# EAGLE board EEZ Arduino shield+BP r2B6b (EAGLE 6.1), part 1 of 2
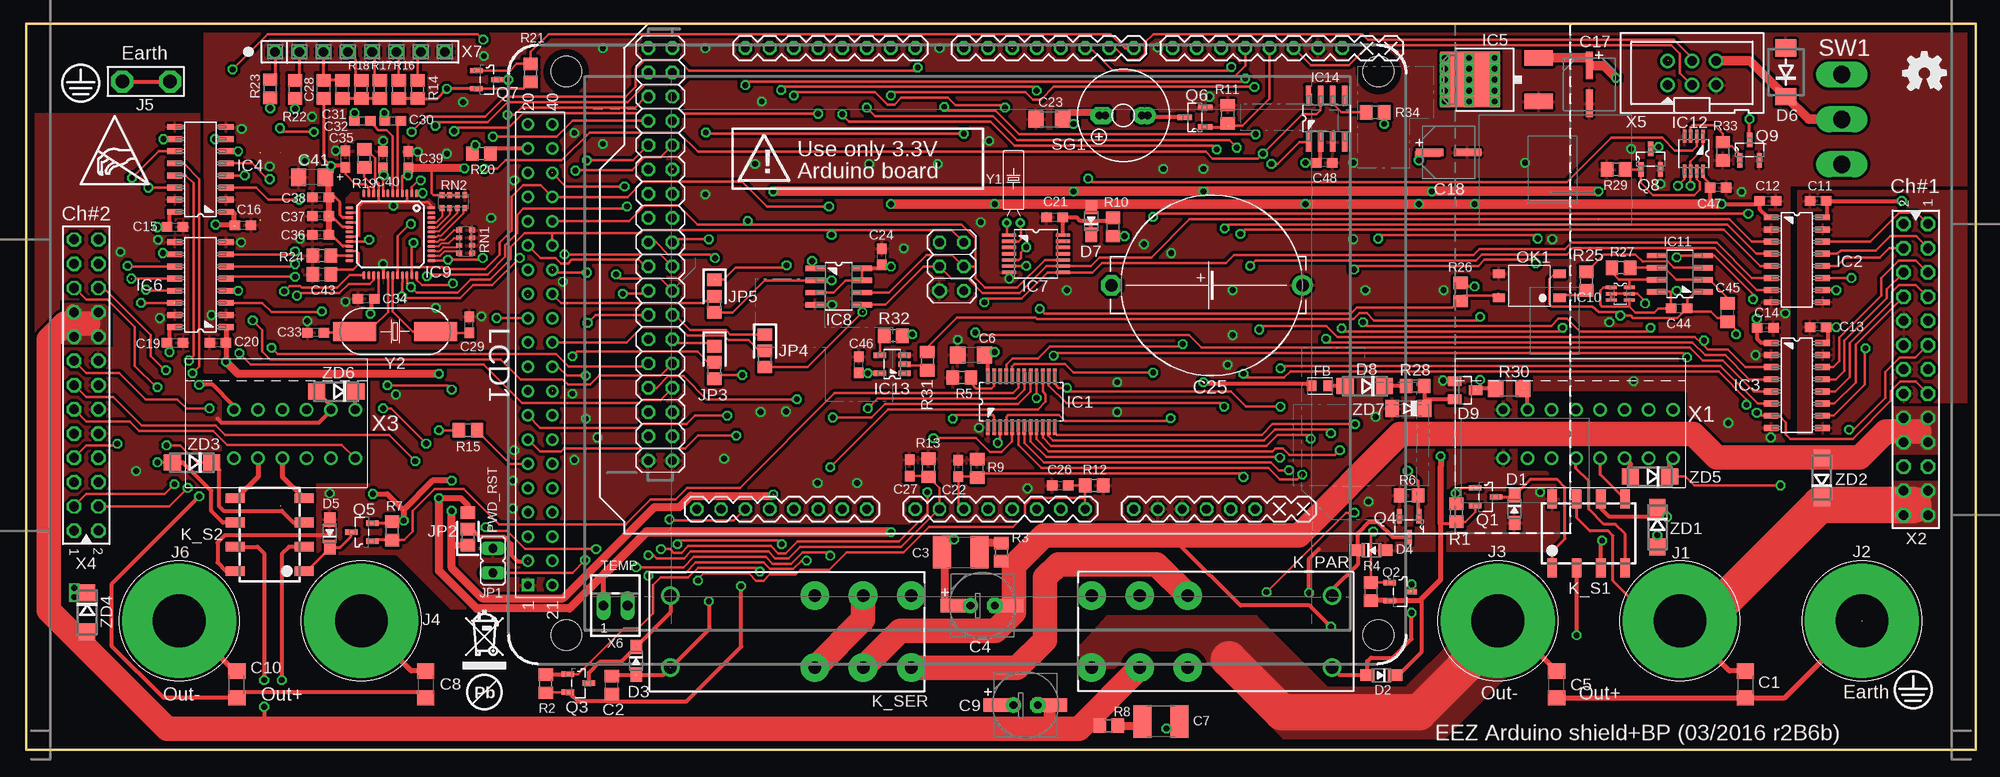
[diagram p4: board, top side]
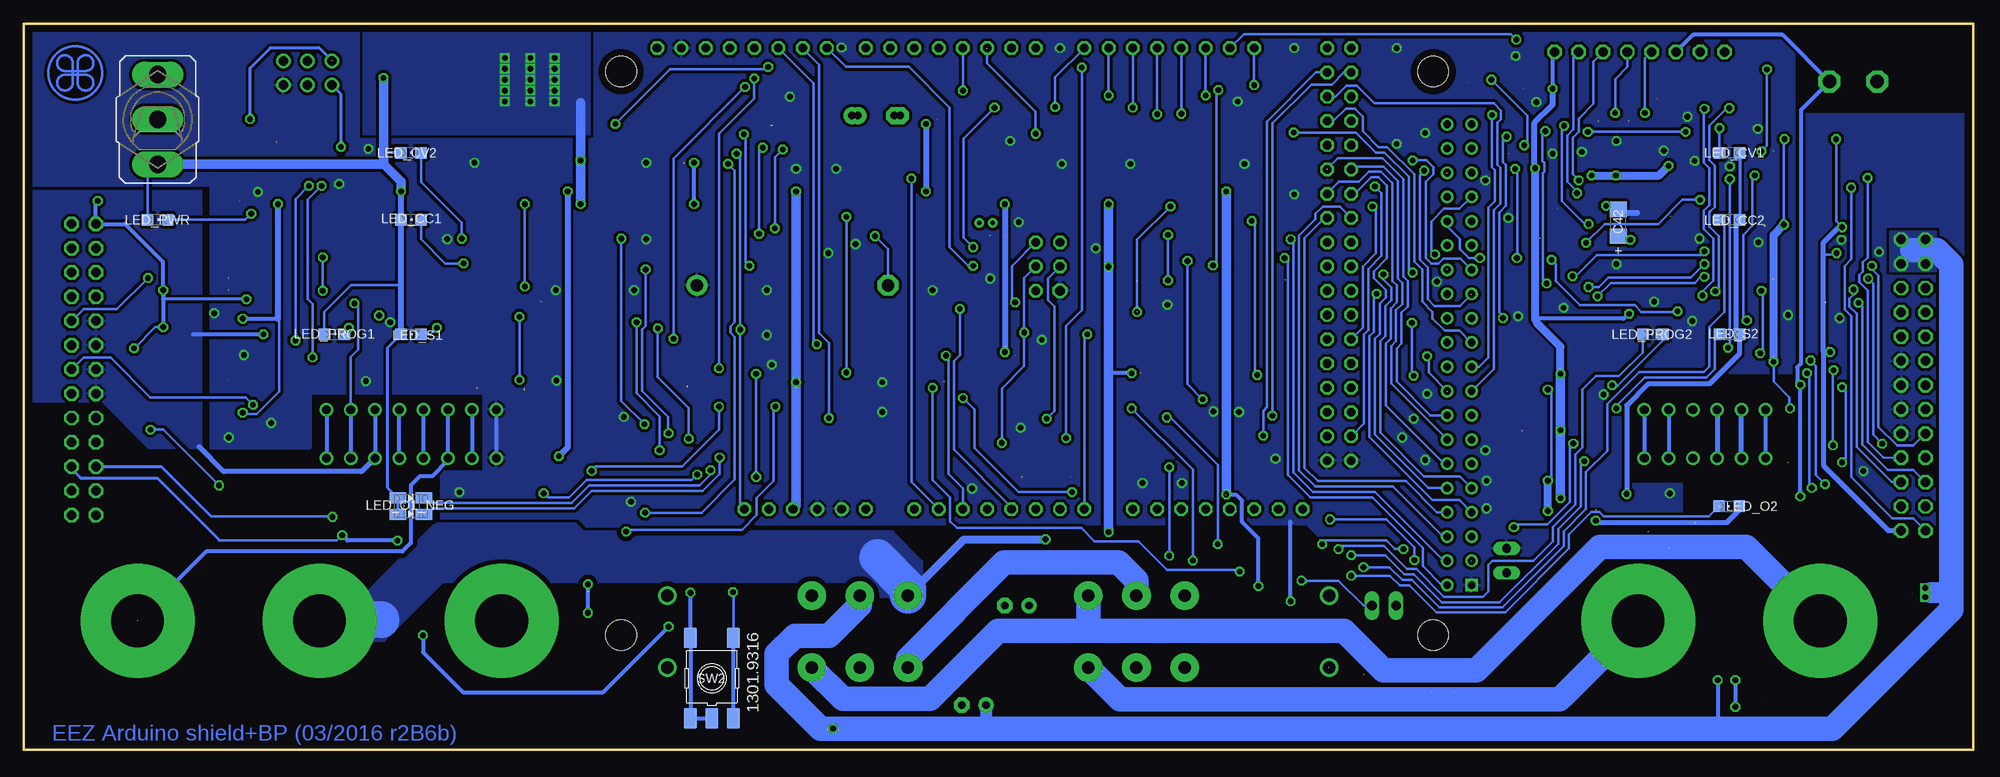
[diagram p5: board, bottom side, seen from below]

Size 204 x 76 mm. Coordinates in mm from the lower left corner, seen from the top.
Outline: 0,0 0,76 204,76 204,0 0,0
Copper layers (1+5*16): Top 0.035mm / dielectric 0.75mm / Route5 0.035mm / dielectric 0.75mm / Bottom 0.035mm
Design rules: minimum track width 10mil, minimum drill 0.5mm, track to track 8mil, track to pad 8mil, pad to pad 8mil, via to via 8mil, smd to smd 8mil, copper to edge 30mil, drill to drill 8mil, minimum pad ring 10mil, minimum via ring 8mil, stop-mask expansion 4mil, vias tented up to drill 25mil, thermal gap 10mil
Net classes: 0 default: width 0.254 mm, drill 0.584 mm, clearance 0.254 mm; 1 power: width 0.254 mm, drill 0.584 mm, clearance 0.254 mm; 2 gnd: width 0.254 mm, drill 0.584 mm, clearance 0.254 mm; 3 isolators: width 0.254 mm, drill 0.584 mm, clearance 0.254 mm

## Footprints (pad centres in the part's own frame; a part is rotated, then mirrored left to right if it is on the bottom)
C1206 = smd 1.6 x 1.8: 1 -1.4,0; 2 1.4,0
C0805 = smd 1.3 x 1.5: 1 -0.95,0; 2 0.95,0
C1812 = smd 1.9 x 3.4: 1 -1.95,0; 2 1.95,0
CAPAE660X610N_COMBO2 = smd 3.6 x 1.4: 1 -2.6,0; 2 2.5,0 | drill 0.813 pad 1.6: 1.1 -1.27,0 | drill 0.813 pad 1.6 octagon: 2.1 1.27,0
C0603 = smd 1.1 x 1: 1 -0.85,0; 2 0.85,0
PANASONIC_C = smd 2.87 x 0.762: 1 -1.981,0; 2 1.981,0
SG-R20MM = drill 1.3 pad 2.184 octagon: 1 10.389,0 | drill 1.3 pad 2.184: 2 -9.601,0
EC1206 = smd 1.6 x 1.8: + -1.4,0; - 1.4,0
SOD323-W = smd 1.5 x 1.2: A 1.45,0; C -1.45,0
DO214AA = smd 1.8 x 2.2: A 2.55,0; C -2.55,0
DO214AC = smd 1.8 x 1.7: A 2.05,0; C -2.05,0
SOT23 = smd 1 x 1.4: 1 -0.95,-1.1; 2 0.95,-1.1; 3 0,1.1
BEAD0603 = smd 1 x 1.1: P$1 -0.85,0; P$2 0.85,0
SOP63P600X175-24N = smd 1.6 x 0.356: 1 -2.667,3.505; 2 -2.667,2.845; 3 -2.667,2.235; 4 -2.667,1.575; 5 -2.667,0.965; 6 -2.667,0.305; 7 -2.667,-0.305; 8 -2.667,-0.965; 9 -2.667,-1.575; 10 -2.667,-2.235; 11 -2.667,-2.845; 12 -2.667,-3.505; 13 2.667,-3.505; 14 2.667,-2.845; 15 2.667,-2.235; 16 2.667,-1.575; 17 2.667,-0.965; 18 2.667,-0.305; 19 2.667,0.305; 20 2.667,0.965; 21 2.667,1.575; 22 2.667,2.235; 23 2.667,2.845; 24 2.667,3.505
SOIC-16 = smd 1.549 x 0.61: 1 -2.692,4.445; 2 -2.692,3.175; 3 -2.692,1.905; 4 -2.692,0.635; 5 -2.692,-0.635; 6 -2.692,-1.905; 7 -2.692,-3.175; 8 -2.692,-4.445; 9 2.692,-4.445; 10 2.692,-3.175; 11 2.692,-1.905; 12 2.692,-0.635; 13 2.692,0.635; 14 2.692,1.905; 15 2.692,3.175; 16 2.692,4.445
DPACK = smd 1.6 x 3: 1 -2.28,-4.8; 3 2.28,-4.8 | smd 5.8 x 6.2: 4 0,2.38
SOP65P640X120-14N = smd 1.473 x 0.356: 1 -2.819,1.956; 2 -2.819,1.295; 3 -2.819,0.66; 4 -2.819,0; 5 -2.819,-0.66; 6 -2.819,-1.295; 7 -2.819,-1.956; 8 2.819,-1.956; 9 2.819,-1.295; 10 2.819,-0.66; 11 2.819,0; 12 2.819,0.66; 13 2.819,1.295; 14 2.819,1.956
SOIC127P600X175-8N = smd 1.981 x 0.559: 1 -2.464,1.905; 2 -2.464,0.635; 3 -2.464,-0.635; 4 -2.464,-1.905; 5 2.464,-1.905; 6 2.464,-0.635; 7 2.464,0.635; 8 2.464,1.905
TQFP48-7X7 = smd 0.85 x 0.32: 1 -4.275,2.75; 2 -4.275,2.25; 3 -4.275,1.75; 4 -4.275,1.25; 5 -4.275,0.75; 6 -4.275,0.25; 7 -4.275,-0.25; 8 -4.275,-0.75; 9 -4.275,-1.25; 10 -4.275,-1.75; 11 -4.275,-2.25; 12 -4.275,-2.75; 25 4.275,-2.75; 26 4.275,-2.25; 27 4.275,-1.75; 28 4.275,-1.25; 29 4.275,-0.75; 30 4.275,-0.25; 31 4.275,0.25; 32 4.275,0.75; 33 4.275,1.25; 34 4.275,1.75; 35 4.275,2.25; 36 4.275,2.75 | smd 0.32 x 0.85: 13 -2.75,-4.275; 14 -2.25,-4.275; 15 -1.75,-4.275; 16 -1.25,-4.275; 17 -0.75,-4.275; 18 -0.25,-4.275; 19 0.25,-4.275; 20 0.75,-4.275; 21 1.25,-4.275; 22 1.75,-4.275; 23 2.25,-4.275; 24 2.75,-4.275; 37 2.75,4.275; 38 2.25,4.275; 39 1.75,4.275; 40 1.25,4.275; 41 0.75,4.275; 42 0.25,4.275; 43 -0.25,4.275; 44 -0.75,4.275; 45 -1.25,4.275; 46 -1.75,4.275; 47 -2.25,4.275; 48 -2.75,4.275
SOT65P210X110-6N = smd 1.168 x 0.356: 1 -0.94,0.66; 2 -0.94,0; 3 -0.94,-0.66; 4 0.94,-0.66; 5 0.94,0; 6 0.94,0.66
SOP65P400X130-8N = smd 1.321 x 0.356: 1 -1.829,0.965; 2 -1.829,0.33; 3 -1.829,-0.33; 4 -1.829,-0.965; 5 1.829,-0.965; 6 1.829,-0.33; 7 1.829,0.33; 8 1.829,0.965
SOT95P280X145-5N = smd 1.27 x 0.559: 1 -1.295,0.94; 2 -1.295,0; 3 -1.295,-0.94; 4 1.295,-0.94; 5 1.295,0.94
BP_5_12 = drill 5.5 pad 11.9: P$1 0,0
PCB_TAB-4.8MM = drill 1.4 pad 2.3 octagon: P$1 -2.54,0; P$2 2.46,0
JP1 = drill 0.914 long: 1 0,-1.27; 2 0,1.27
A0R-JMP = smd 1.5 x 1.3: 1 0,1.7; 2 0,0; 3 0,-1.7
RT-C/016A5_ROUND = drill 1.3 pad 3: 11A 8.83,3.78; 11B 8.83,-3.78; 12A 3.79,3.78; 12B 3.79,-3.78; 14A 13.87,3.78; 14B 13.87,-3.78 | drill 1.3: A1 -11.33,-3.78; A2 -11.33,3.78
G6K-2F = smd 1 x 2: 1 -3.81,-3.6; 2 -1.27,-3.6; 3 1.27,-3.6; 4 3.81,-3.6; 5 3.81,3.6; 6 1.27,3.6; 7 -1.27,3.6; 8 -3.81,3.6
LCD_TFT_320QVT_MIRROR = drill 0.8 square: 1 48.26,0 | drill 0.8: 2 45.72,0; 3 43.18,0; 4 40.64,0; 5 38.1,0; 6 35.56,0; 7 33.02,0; 8 30.48,0; 9 27.94,0; 10 25.4,0; 11 22.86,0; 12 20.32,0; 13 17.78,0; 14 15.24,0; 15 12.7,0; 16 10.16,0; 17 7.62,0; 18 5.08,0; 19 2.54,0; 20 0,0; 21 48.26,2.54; 22 45.72,2.54; 23 43.18,2.54; 24 40.64,2.54; 25 38.1,2.54; 26 35.56,2.54; 27 33.02,2.54; 28 30.48,2.54; 29 27.94,2.54; 30 25.4,2.54; 31 22.86,2.54; 32 20.32,2.54; 33 17.78,2.54; 34 15.24,2.54; 35 12.7,2.54; 36 10.16,2.54; 37 7.62,2.54; 38 5.08,2.54; 39 2.54,2.54; 40 0,2.54 | hole 3.2: -5.5,4; 53.5,4; -5.5,89; 53.5,89
CHIPLED_0805 = smd 1.2 x 1.2: A 0,-1.05; C 0,1.05
LED_KPB-3025 = smd 1.7 x 1.15: 1 1.35,0.875; 2 -1.35,0.875; 3 1.35,-0.875; 4 -1.35,-0.875
ARDUINO+ICSP_MIRROR = drill 0.9 octagon: 0 63.5,2.54; 1 60.96,2.54; 2 58.42,2.54; 3 55.88,2.54; 3.3V 35.56,50.8; 4 53.34,2.54; 5 50.8,2.54; 5V 38.1,50.8; 5V(1) 93.98,2.54; 5V(2) 96.52,2.54; 6 48.26,2.54; 7 45.72,2.54; 8 41.656,2.54; 9 39.116,2.54; 10 36.576,2.54; 11 34.036,2.54; 12 31.496,2.54; 13 28.956,2.54; 14 68.58,2.54; 15 71.12,2.54; 16 73.66,2.54; 17 76.2,2.54; 18 78.74,2.54; 19 81.28,2.54; 20 83.82,2.54; 21 86.36,2.54; 22 93.98,5.08; 23 96.52,5.08; 24 93.98,7.62; 25 96.52,7.62; 26 93.98,10.16; 27 96.52,10.16; 28 93.98,12.7; 29 96.52,12.7; 30 93.98,15.24; 31 96.52,15.24; 32 93.98,17.78; 33 96.52,17.78; 34 93.98,20.32; 35 96.52,20.32; 36 93.98,22.86; 37 96.52,22.86; 38 93.98,25.4; 39 96.52,25.4; 40 93.98,27.94; 41 96.52,27.94; 42 93.98,30.48; 43 96.52,30.48; 44 93.98,33.02; 45 96.52,33.02; 46 93.98,35.56; 47 96.52,35.56; 48 93.98,38.1; 49 96.52,38.1; 50 93.98,40.64; 51 96.52,40.64; 52 93.98,43.18; 53 96.52,43.18; A0 50.8,50.8; A1 53.34,50.8; A2 55.88,50.8; A3 58.42,50.8; A4 60.96,50.8; A5 63.5,50.8; A6 66.04,50.8; A7 68.58,50.8; A8 73.66,50.8; A9 76.2,50.8; A10 78.74,50.8; A11 81.28,50.8; A12 83.82,50.8; A13 86.36,50.8; A14 88.9,50.8; A15 91.44,50.8; AREF 23.876,2.54; GND 26.416,2.54; GND1 40.64,50.8; GND2 43.18,50.8; GND3 93.98,45.72; GND4 96.52,45.72; ICSP_+5V 66.04,22.86; ICSP_MISO 63.5,22.86; ICSP_MOSI 66.04,25.4; ICSP_RESET 63.5,27.94; ICSP_SCK 63.5,25.4; RESET 33.02,50.8; VIN 45.72,50.8 | drill 1.016 octagon: ICSP_GND 66.04,27.94
HCPL-181 = smd 0.889 x 1.27: 1 -1.27,-3.175; 2 1.27,-3.175; 3 1.27,3.175; 4 -1.27,3.175
SOT95P237X112-3N = smd 1.321 x 0.559: 1 -1.092,0.94; 2 -1.092,-0.94; 3 1.092,0
SOT103P240X110-3N = smd 1.524 x 0.559: 1 -1.079,1.016; 2 -1.079,-1.016; 3 1.079,0
R0805 = smd 1.3 x 1.5: 1 -0.95,0; 2 0.95,0
R1206 = smd 1.6 x 1.803: 1 -1.422,0; 2 1.422,0
CAY16 = smd 0.5 x 0.65: 1 -1.2,-0.675; 2 -0.4,-0.675; 3 0.4,-0.675; 4 1.2,-0.675; 5 1.2,0.675; 6 0.4,0.675; 7 -0.4,0.675; 8 -1.2,0.675
BUZZER = drill 0.8 pad 1.778 octagon: + 1.905,0; +B 2.54,0 | drill 0.8 pad 1.778: - -1.905,0; -B -2.54,0
SHORT_NOHOLE = smd 0.5 x 0.25 bottom: P$1 0,0.117; P$2 0,-0.117
M9040P = drill 1.803 long: 1 0,4.699; 2 0,0; 3 0,-4.699
TACTM-6XN = smd 2.1 x 1.4: 1 -4.2,2.25; 2 4.2,2.25; 3 -4.2,-2.25; 4 4.2,-2.25; 5 -4.2,0
MC000006_MIRROR = drill 0.9: 1 0,0; 1.1 0,-5.08; 2 -2.54,0; 2.1 -2.54,-5.08; 3 -5.08,0; 3.1 -5.08,-5.08; 4 -7.62,0; 4.1 -7.62,-5.08; 5 -10.16,0; 5.1 -10.16,-5.08; 6 -12.7,0; 6.1 -12.7,-5.08; 7 -15.24,0; 7.1 -15.24,-5.08; 8 -17.78,0; 8.1 -17.78,-5.08
TSW-113-07-F-D = drill 1 pad 1.5 octagon: 1 30.48,0; 2 30.48,2.54; 3 27.94,0; 4 27.94,2.54; 5 25.4,0; 6 25.4,2.54; 7 22.86,0; 8 22.86,2.54; 9 20.32,0; 10 20.32,2.54; 11 17.78,0; 12 17.78,2.54; 13 15.24,0; 14 15.24,2.54; 15 12.7,0; 16 12.7,2.54; 17 10.16,0; 18 10.16,2.54; 19 7.62,0; 20 7.62,2.54; 21 5.08,0; 22 5.08,2.54; 23 2.54,0; 24 2.54,2.54; 25 0,0; 26 0,2.54
MC000005_MIRROR = drill 0.9: 1 0,0; 1.1 0,-5.08; 2 -2.54,0; 2.1 -2.54,-5.08; 3 -5.08,0; 3.1 -5.08,-5.08; 4 -7.62,0; 4.1 -7.62,-5.08; 5 -10.16,0; 5.1 -10.16,-5.08; 6 -12.7,0; 6.1 -12.7,-5.08
IDC-6PIN = drill 1 pad 1.422: 1 -2.54,-1.27; 2 -2.54,1.27; 3 0,-1.27; 4 0,1.27; 5 2.54,-1.27; 6 2.54,1.27
22-23-2021 = drill 1 long: 1 -1.27,0; 2 1.27,0
SSW-108-02-S-S = drill 1 pad 1.5 octagon: 1 -8.89,0; 2 -6.35,0; 3 -3.81,0; 4 -1.27,0; 5 1.27,0; 6 3.81,0; 7 6.35,0; 8 8.89,0
R26_XTAL = drill 0.5: 1 -0.7,0; 2 0.7,0
HC-49/4H = smd 4.5 x 2: 1 -4.25,0; 2 4.25,0
MINIMELF = smd 1.4 x 1.8: A 1.7,0; C -1.7,0

## Placement (x,y rotation side)
C1  10n  [C1206]  179.9,6.85 270 top
C2  1u  [C0805]  61.28,6.79 90 top
C3  470n/100V  [C1812]  97.79,20.69 0 top
C4  22u/63V  [CAPAE660X610N_COMBO2]  100.08,15.11 0 top
C5  10n  [C1206]  160.15,6.85 90 top
C6  10u  [C1206]  98.87,41.33 180 top
C7  470n/100V  [C1812]  118.75,2.98 180 top
C8  10n  [C1206]  41.78,6.85 270 top
C9  22u/63V  [CAPAE660X610N_COMBO2]  104.58,4.69 0 top
C10  10n  [C1206]  22.03,6.85 90 top
C11  100n  [C0603]  187.52,57.46 180 top
C12  100n  [C0603]  182.25,57.46 0 top
C13  100n  [C0603]  187.52,44.25 180 top
C14  100n  [C0603]  181.99,44.19 0 top
C15  100n  [C0603]  15.56,54.73 0 top
C16  100n  [C0603]  22.67,54.92 0 top
C17  47u  [PANASONIC_C]  163.58,69.65 270 top
C18  10u  [PANASONIC_C]  148.84,62.54 0 top
C19  100n  [C0603]  15.56,42.6 0 top
C20  100n  [C0603]  20.07,42.6 180 top
C21  100n  [C0603]  107.63,55.74 0 top
C22  100n  [C0603]  97.54,29.46 270 top
C23  10u  [C1206]  107.06,66.03 0 top
C24  100n  [C0603]  89.53,51.62 90 top
C25  EECS5R5H105  [SG-R20MM]  123.95,48.63 180 top
C26  100n  [C0603]  108.2,27.68 0 top
C27  100n  [C0603]  92.46,29.52 270 top
C28  22n  [C0805]  31.11,69.14 90 top
C29  18p  [C0603]  46.35,44.51 90 top
C30  6n8  [C0603]  38.35,65.84 0 top
C31  10n  [C0805]  33.08,69.14 90 top
C32  6n8  [C0603]  35.18,65.84 0 top
C33  18p  [C0603]  30.29,43.68 180 top
C34  100n  [C0603]  35.56,47.24 0 top
C35  100n  [C0603]  33.4,61.84 90 top
C36  100n  [C0603]  30.8,53.9 180 top
C37  100n  [C0603]  30.8,55.87 180 top
C38  100n  [C0603]  30.8,57.84 180 top
C39  100n  [C0603]  40.01,61.78 90 top
C40  100n  [C0603]  37.34,61.78 90 top
C41  10u  [EC1206]  29.91,59.94 180 top
C42  4u7  [EC1206]  37.15,55.17 90 bottom
C43  10n  [C0805]  30.92,49.78 0 top
C44  100n  [C0603]  172.97,46.22 0 top
C45  47n  [C0805]  178.05,45.78 90 top
C46  100n  [C0603]  87.12,40.31 90 top
C47  100n  [C0603]  177.04,58.86 180 top
C48  100n  [C0603]  135.83,61.46 180 top
D1  BAS316  [SOD323-W]  155.74,25.21 270 top
D2  BAS316  [SOD323-W]  141.8,7.8 180 top
D3  BAS316  [SOD323-W]  63.82,9.33 270 top
D4  BAS316  [SOD323-W]  140.78,20.88 0 top
D5  BAS316  [SOD323-W]  31.75,22.66 90 top
D6  SMBJ5.0A-TR  [DO214AA]  184.15,70.92 90 top
D7  BAS316  [SOD323-W]  111.44,55.36 90 top
D8  SKL16  [DO214AC]  140.08,38.09 180 top
D9  BAT54S  [SOT23]  150.56,37.65 270 top
EEZ_SIGNATURE  SIGNATURESMALL  [SIGNATURE_5MM]  198.62,70.87 180 top
FB  60R@100MHz  [BEAD0603]  135.38,38.09 0 top
IC1  TLC5925  [SOP63P600X175-24N]  104.14,36.44 90 top
IC2  Si8641EC-B-IS1  [SOIC-16]  185.29,51.3 0 top
IC3  Si8641EC-B-IS1  [SOIC-16]  185.29,38.16 0 top
IC4  Si8641EC-B-IS1  [SOIC-16]  18.22,60.76 180 top
IC5  LD1117ADT33TR  [DPACK]  153.48,70.16 90 top
IC6  Si8641EC-B-IS1  [SOIC-16]  18.22,48.7 180 top
IC7  PCA21125  [SOP65P640X120-14N]  105.66,51.94 0 top
IC8  AT25256B  [SOIC127P600X175-8N]  85.03,48.51 0 top
IC9  W5500  [TQFP48-7X7]  38.1,53.97 270 top
IC10  BC857BS  [SOT65P210X110-6N]  166.81,47.74 0 top
IC11  TLC555  [SOIC127P600X175-8N]  173.04,49.84 180 top
IC12  SN74LVC2G08DCTR  [SOP65P400X130-8N]  174.5,62.41 270 top
IC13  SN74LV1T34  [SOT95P280X145-5N]  90.61,40.38 180 top
IC14  TPS3705-33D  [SOIC127P600X175-8N]  136.08,66.1 90 top
J1  BS-244DSM-R  [BP_5_12]  173.05,13.5 0 top
J2  BS-244DSM-G  [BP_5_12]  192.1,13.5 0 top
J3  BS-244DSM-B  [BP_5_12]  154,13.5 0 top
J4  BS-244DSM-R  [BP_5_12]  35.05,13.5 0 top
J5  1-726388-2  [PCB_TAB-4.8MM]  12.51,69.97 180 top
J6  BS-244DSM-B  [BP_5_12]  16,13.5 0 top
JP1  826926-2  [JP1]  48.83,19.8 0 top
JP2  0R-JUMPA  [A0R-JMP]  46.23,23.11 180 top
JP3  0R-JUMPA  [A0R-JMP]  72.01,40.57 180 top
JP4  0R-JUMPA  [A0R-JMP]  77.28,41.77 180 top
JP5  0R-JUMPA  [A0R-JMP]  72.01,47.49 180 top
K_PAR  RT424005  [RT-C/016A5_ROUND]  125.35,12.37 180 top
K_S1  G6K-2F-5DC  [G6K-2F]  163.51,22.66 0 top
K_S2  G6K-2F-5DC  [G6K-2F]  25.46,22.53 90 top
K_SER  RT424005  [RT-C/016A5_ROUND]  78.74,12.37 0 top
LCD1  TFT_320QVT  [LCD_TFT_320QVT_MIRROR]  52.5,65.5 270 top
LED_CC1  HSMH-C170  [CHIPLED_0805]  163.5,55.5 270 bottom
LED_CC2  HSMH-C170  [CHIPLED_0805]  25.5,55.5 90 bottom
LED_CV1  HSMY-C170  [CHIPLED_0805]  25.5,62.5 90 bottom
LED_CV2  HSMY-C170  [CHIPLED_0805]  163.5,62.5 270 bottom
LED_O1_NEG  HSMF-C155  [LED_KPB-3025]  163.5,25.5 180 bottom
LED_O2  HSMG-C170  [CHIPLED_0805]  25.52,25.5 90 bottom
LED_PROG1  HSMH-C170  [CHIPLED_0805]  171.5,43.5 270 bottom
LED_PROG2  HSMH-C170  [CHIPLED_0805]  33.5,43.5 90 bottom
LED_PWR  OSB50805C1E  [CHIPLED_0805]  190,55.5 270 bottom
LED_S1  HSMY-C170  [CHIPLED_0805]  163.5,43.5 270 bottom
LED_S2  HSMY-C170  [CHIPLED_0805]  25.5,43.5 90 bottom
MCU  Arduino Due  [ARDUINO+ICSP_MIRROR]  161.61,76 180 top
OK1  HCPL-181  [HCPL-181]  157.29,48.57 90 top
Q1  IRLML2246TRPBF  [SOT95P237X112-3N]  152.72,26.47 0 top
Q2  IRLML2246TRPBF  [SOT95P237X112-3N]  143.76,16.57 0 top
Q3  IRLML2246TRPBF  [SOT95P237X112-3N]  57.78,6.98 0 top
Q4  2N7002  [SOT103P240X110-3N]  144.72,23.36 270 top
Q5  IRLML2246TRPBF  [SOT95P237X112-3N]  35.12,22.79 180 top
Q6  2N7002  [SOT103P240X110-3N]  122.3,66.22 180 top
Q7  IRLML2246TRPBF  [SOT95P237X112-3N]  48.2,70.16 0 top
Q8  2N7002  [SOT103P240X110-3N]  169.99,61.84 90 top
Q9  2N7002  [SOT103P240X110-3N]  180.34,62.79 90 top
R1  4K7  [R0805]  149.67,24.82 270 top
R2  4K7  [R0805]  54.36,6.91 270 top
R3  1R  [R0805]  102.04,20.69 90 top
R4  100K  [R0805]  140.72,16.57 270 top
R5  1K5  [R0805]  97.92,38.98 0 top
R6  100K  [R0805]  144.72,26.62 0 top
R7  4K7  [R0805]  38.29,22.92 90 top
R8  1R  [R0805]  113.28,2.53 0 top
R9  4K7  [R0805]  99.5,29.46 90 top
R10  180R  [R0805]  113.73,54.73 90 top
R11  100K  [R0805]  125.73,66.54 270 top
R12  4K7  [R0805]  111.76,27.68 0 top
R13  4K7  [R0805]  94.42,29.52 90 top
R14  49R9  [R0805]  40.96,69.14 90 top
R15  10K  [R0805]  46.23,33.46 180 top
R16  49R9  [R0805]  38.99,69.14 270 top
R17  49R9  [R0805]  37.02,69.14 90 top
R18  49R9  [R0805]  35.05,69.14 270 top
R19  12K4  [R0805]  35.37,61.9 270 top
R20  10R  [R0805]  47.62,62.41 0 top
R21  100K  [R0805]  52.77,70.86 270 top
R22  180R  [R0805]  28.13,69.14 90 top
R23  180R  [R0805]  25.53,69.21 90 top
R24  10K  [R0805]  30.92,51.74 0 top
R25  180R  [R0805]  163.26,49.08 270 top
R26  1K5  [R0805]  150.11,47.93 270 top
R27  1K5  [R0805]  166.88,50.47 0 top
R28  100R  [R0805]  145.35,38.09 180 top
R29  30K  [R0805]  166.37,60.76 180 top
R30  10K  [R1206]  155.19,37.84 180 top
R31  1K  [R0805]  94.3,40.7 90 top
R32  1K  [R0805]  90.74,43.36 180 top
R33  30K  [R0805]  177.55,62.67 270 top
R34  0R  [R0805]  141.16,66.73 0 top
RN1  4x10K  [CAY16]  45.97,53.2 270 top
RN2  4x10K  [CAY16]  44.7,57.4 0 top
SG1  LD-BZEN-0903  [BUZZER]  114.81,66.41 180 top
SH1  [SHORT_NOHOLE]  36.51,56.19 90 top
SW1  A101SYCQ04  [M9040P]  190,66 0 bottom
SW2  1301.9316  [TACTM-6XN]  132,7.5 90 bottom
U$2  [RECYCLE_BIN1/8]  45.66,8.44 0 top
U$3  [PB_SMALL]  47.95,6.03 0 top
U$4  [ESD_SYMBOL]  5.68,59.22 0 top
X1  MC000006  [MC000006_MIRROR]  154.56,30.54 180 top
X2  TSW-113-07-F-D  [TSW-113-07-F-D]  199,24.58 90 top
X3  MC000005  [MC000005_MIRROR]  21.72,30.54 180 top
X4  TSW-113-07-F-D  [TSW-113-07-F-D]  5,53.42 270 top
X5  09185067324  [IDC-6PIN]  174.31,70.86 0 top
X6  22-23-2021  [22-23-2021]  61.66,15.11 0 top
X7  826629-8  [SSW-108-02-S-S]  34.92,73.08 0 top
Y1  32,768kHz  [R26_XTAL]  103.31,55.17 0 top
Y2  25MHz  [HC-49/4H]  38.61,43.81 180 top
ZD1  P4SMAJ60A  [DO214AC]  170.69,23.3 270 top
ZD2  P4SMAJ60A  [DO214AC]  187.9,28.5 90 top
ZD3  P4SMAJ60A  [DO214AC]  17.34,30.09 180 top
ZD4  P4SMAJ60A  [DO214AC]  6.35,14.39 270 top
ZD5  SMAJ18A  [DO214AC]  169.93,28.63 180 top
ZD6  SMAJ18A  [DO214AC]  32.45,37.52 180 top
ZD7  4V3  [MINIMELF]  144.65,35.74 180 top

## Tracks (layer width: path | path; a pad name or v marks a point on that pad's centre or on a via)
1V2O
  Top 0.254: IC9.22 34.58,52.22 34.8,52 34.8,50.85 34.23,50.28 32.32,50.28 31.88,49.84 C43.2
!ADC1_SELECT  (via drill 0.6)  (1 unrouted)
  Top 0.254: v90.49,68.51 90.81,68.83 104.58,68.83 105.35,68.06 106.17,68.06 107.5,69.4 v128.52,69.4 | v136.02,43.05 136.02,42.98 136.33,42.66 174.37,42.66 175.7,41.33 177.8,41.33 180.34,38.79 182.63,38.79
  Bottom 0.254: MCU.15 v90.49,68.51 | v128.52,69.4 136.02,61.9 v136.02,43.05
!ADC2_SELECT  (via drill 0.6)
  Top 0.254: MCU.48 66.36,36.63 64.45,36.63 64.14,36.31 51.88,36.31 47.88,40.31 23.5,40.31 v22.29,41.52 | IC6.4 v22.16,48.06
  Bottom 0.254: v22.16,48.06 22.04,47.93 22.04,41.77 v22.29,41.52
!BP_OE  (via drill 0.6)
  Top 0.254: IC1.21 102.56,40.33 103.19,40.95 105.86,40.95 107.12,42.22 121.03,42.22 v121.03,42.47
  Bottom 0.254: v121.03,42.47 121.35,42.79 121.35,69.78 MCU.10
!BP_OUT0  (via drill 0.6)  (1 unrouted)
  Top 0.254: IC1.5 103.17,32.3 102.04,31.17 100.84,31.17 99.38,32.63 v94.93,32.63 | v30.1,64.7 26.92,64.7 v26.54,65.08 | v40.32,64.7 41.91,66.29 48.01,66.29 50.1,68.38 62.74,68.38 63.75,69.4 63.75,71.24 64.71,72.19 68.26,72.19 69.34,71.11 92.96,71.11 v93.28,71.43
  Bottom 0.254: v40.32,64.7 v30.1,64.7 | v26.54,65.08 26.54,62.54 26.48,62.54 | v94.93,32.63 94.93,44.38 93.28,46.03 v93.28,71.43
!BP_OUT1  (via drill 0.6)
  Top 0.254: R1.1 v149.61,26.85 150.16,27.41 Q1.1 | IC1.6 103.83,31.92 106.24,29.52 129.98,29.52 131.19,28.31 133.03,28.31 v133.54,28.82
  Bottom 0.254: v149.61,26.85 149.16,26.41 146.94,26.41 145.1,28.25 134.11,28.25 v133.54,28.82
!BP_OUT2  (via drill 0.6)
  Top 0.254: IC1.7 104.44,32.14 106.49,30.09 130.24,30.09 131.06,29.27 v132.14,29.27
  Bottom 0.254: LED_O1_NEG.4 161.76,26.38 161.23,25.84 146.69,25.84 144.84,27.68 133.29,27.68 132.14,28.82 v132.14,29.27
!BP_OUT3  (via drill 0.6)
  Top 0.254: IC1.8 105.11,32.3 106.74,30.66 131.06,30.66 v131.19,30.6
  Bottom 0.254: LED_O1_NEG.2 161.74,24.62 161.1,25.27 146.43,25.27 144.59,27.11 132.97,27.11 131.19,28.88 v131.19,30.6
!BP_OUT4  (via drill 0.6)
  Top 0.254: IC1.9 105.72,32.52 107,31.23 130.43,31.23 130.75,31.55 131.51,31.55 132.21,30.85 136.97,30.85 v137.48,31.36 | v139.89,44.76 140.27,44.38 159.58,44.38 160.34,45.14 161.23,45.14 162.56,43.81 169.61,43.81 v169.99,44.19
  Bottom 0.254: v139.89,44.76 139.89,37.33 137.48,34.92 v137.48,31.36 | v169.99,44.19 169.99,43.96 LED_PROG1.C
!BP_OUT5  (via drill 0.6)
  Top 0.254: IC1.10 106.38,32.68 107.25,31.8 129.79,31.8 130.94,32.95 134.05,32.95 v134.43,32.57 | v160.78,44.19 160.4,43.81 137.99,43.81 v137.67,44.12
  Bottom 0.254: LED_S1.C 161.47,43.5 v160.78,44.19 | v137.67,44.12 137.67,39.04 134.43,35.81 v134.43,32.57
!BP_OUT6  (via drill 0.6)
  Top 0.254: IC1.11 106.98,32.83 107.44,32.38 129.54,32.38 130.68,33.52 136.14,33.52 v136.53,33.14 | v138.94,50.28 139.32,50.66 151.96,50.66 152.59,51.3 157.61,51.3 v157.99,50.92
  Bottom 0.254: v138.94,50.28 138.94,44.38 139.32,44 139.32,37.58 136.59,34.85 136.59,33.2 v136.53,33.14 | 162.43,55.48 162.43,53.46 159.89,50.92 v157.99,50.92
  Bottom 0.305: 162.43,55.48 LED_CC1.C
!BP_OUT7  (via drill 0.6)
  Top 0.254: IC1.12 107.64,33.19 107.89,32.95 129.29,32.95 130.43,34.09 v139.06,34.09 | v141.48,53.52 141.86,53.9 157.8,53.9 v158.18,53.52
  Bottom 0.254: v141.48,53.52 141.48,36.51 v139.06,34.09 | LED_CV2.C 162.45,59.45 158.18,55.17 v158.18,53.52
!BP_OUT8  (via drill 0.6)  (1 unrouted)
  Top 0.254: Q3.1 57.77,7.92 62.55,12.69 64.01,12.69 65.6,14.28 65.6,17.26 66.36,18.03 69.28,18.03 70.29,19.04 76.39,19.04 v76.77,18.66 | IC1.13 107.64,38.59 | 107.7,38.54 107.7,38.22 108.01,37.9 v108.9,37.9 109.28,37.52 126.05,37.52 127.64,35.93 v131.25,35.93 | R6.2 145.67,28.12 v144.59,29.2
  Top 0.305: Q4.1 145.73,26.56 R6.2
  Top 0.406: Q3.1 56.64,7.86 R2.1
  Bottom 0.254: v108.9,37.9 108.9,28.25 107.06,26.41 107.06,23.93 106.36,23.23 93.34,23.23 91.95,21.84 87.38,21.84 84.39,18.85 76.96,18.85 v76.77,18.66 | v144.59,29.2 144.15,29.65 135.13,29.65 131.25,33.52 v131.25,35.93
!BP_OUT9  (via drill 0.6)
  Top 0.254: Q2.1 R4.1 140.72,22.6 v140.97,22.85 | v125.35,35.93 124.97,36.31 108.84,36.31 107,38.16 107,39.09 IC1.14
  Bottom 0.254: v125.35,35.93 125.54,35.74 125.54,28.12 127.32,26.34 127.32,24.57 128.84,23.04 140.78,23.04 v140.97,22.85
!BP_OUT10  (via drill 0.6)
  Top 0.254: IC1.15 106.38,37.51 106.68,37.2 106.68,36.44 105.86,35.62 90.17,35.62 v84.14,29.58 | v84.14,20.31 83.76,20.69 81.22,20.69 80.01,19.49 78.11,19.49 77.41,20.18 69.85,20.18 68.77,19.11 v63.82,19.11
  Bottom 0.254: v84.14,29.58 v84.14,20.31 | 26.8,55.25 26.24,55.25 26.1,55.11 26.1,54.98 26.04,54.92 26.04,45.84 27.62,44.25 27.62,40.12 28.19,39.55 34.92,39.55 38.29,36.19 38.29,31.3 40.51,29.07 40.51,25.2 42.86,22.85 42.86,21.33 49.28,14.91 55.88,14.91 58.74,17.77 59.75,17.77 61.09,19.11 v63.82,19.11
  Bottom 0.305: 26.8,55.25 LED_CC2.C
!BP_OUT12  (via drill 0.6)  (1 unrouted)
  Top 0.254: v59.63,21.01 52.2,21.01 50.29,22.92 48.45,22.92 v48.07,23.3 | v68.14,21.52 68.52,21.9 78.68,21.9 v79.06,21.52 | v84.39,34.79 88.46,34.79 89.85,36.19 103.76,36.19 105.11,37.53 IC1.17 | v37.34,35.74 38.16,35.74 v41.85,32.06
  Bottom 0.254: v59.63,21.01 60.52,21.01 61.4,21.9 67.75,21.9 v68.14,21.52 | v79.06,21.52 79.06,29.84 84.01,34.79 v84.39,34.79 | v48.07,23.3 47.75,23.61 44.58,23.61 42.23,25.96 42.23,31.68 v41.85,32.06 | v37.34,35.74 37.34,36 34.35,38.98 27.94,38.98 27.05,39.87 27.05,42.98 26.54,43.49
!BP_OUT13  (via drill 0.6)  (1 unrouted)
  Top 0.254: 88.46,36.12 v88.08,35.74 89.09,36.76 103.5,36.76 104.44,37.7 IC1.18 | v65.09,18.22 65.47,18.6 69.03,18.6 70.04,19.61 77.15,19.61 77.85,18.91 80.26,18.91 81.15,19.8 v81.66,19.8
  Bottom 0.254: v81.66,19.8 81.66,29.33 v88.08,35.74 | v65.09,18.22 61.02,18.22 60.01,17.2 58.99,17.2 56.2,14.41 48.96,14.41 42.29,21.07 42.29,22.54 39.94,24.88 39.12,24.88 38.67,24.44 27.69,24.44 26.61,25.52
!BP_OUT14
  Top 0.254: R7.1 39.56,21.96 40.45,22.85 40.45,25.01 42.74,27.3 45.78,27.3 49.47,23.61 62.74,23.61 65.34,26.22 67.94,26.22 69.15,27.42 74.68,27.42 84.58,37.33 103.25,37.33 103.83,37.91 IC1.19
  Top 0.305: R7.1 36.33,21.96 Q5.1
!BP_OUT15  (via drill 0.6)
  Top 0.254: 103.19,39.12 IC1.20 103.17,40.11 103.44,40.38 108.71,40.38 109.6,39.49 v117.92,39.49 | v180.21,56.13 118.24,56.13 v117.92,55.81
  Bottom 0.254: LED_PWR.C 180.86,55.5 v180.21,56.13 | v117.92,39.49 v117.92,55.81
!CH1_ADC
  Top 0.254: IC3.13 189.36,38.79 190.25,39.68 190.25,42.85 194.69,47.3 194.69,48.21 X2.6 196.46,49.94
!CH1_DAC
  Top 0.254: IC2.12 189.48,50.66 190.34,51.52 193.96,51.52 194.96,52.52 X2.4
!CH1_EXPANDER
  Top 0.254: X2.3 199,52.56 197.8,53.76 195.07,53.76 193.56,52.25 189.87,52.25 189.55,51.94 IC2.13 188.43,52
!CH1_INT
  Top 0.254: IC3.11 189.23,36.25 191.45,38.47 191.45,42.43 X2.8
!CH1_RESET
  Top 0.254: IC3.14 189.1,40.06 189.74,40.7 189.74,43.17 194.12,47.55 194.12,49.38 195.96,51.22 197.76,51.22 X2.5
!CH2_ADC  (via drill 0.6)
  Top 0.254: IC6.13 12.64,48.06 v12.51,48.19
  Bottom 0.254: v12.51,48.19 12.51,47.68 12.95,47.24 12.95,46.41 12.19,45.65 12.19,31.73 8.52,28.05 X4.6 7.63,28.05
!CH2_DAC  (via drill 0.6)
  Top 0.254: IC4.12 16.45,61.4 18.1,59.74 18.1,40.12 v17.4,39.42 | X4.4 14.95,25.48 v16.89,27.42
  Bottom 0.254: v17.4,39.42 17.14,39.17 17.14,27.68 v16.89,27.42
!CH2_EXPANDER  (via drill 0.6)
  Top 0.254: 5,25.52 X4.3 5.02,25.51 6.29,26.77 14.46,26.77 v15.49,27.8 | 15.47,60.19 IC4.13 16.7,60.13 17.53,59.3 17.53,41.27 v17.02,40.76
  Bottom 0.254: v17.02,40.76 16.45,40.19 16.45,28.76 v15.49,27.8
!CH2_INT  (via drill 0.6)
  Top 0.254: IC4.11 13.84,62.67 v11.05,59.87
  Bottom 0.254: X4.8 9.4,30.59 11.05,32.23 11.05,48.06 11.94,48.95 11.94,49.71 11.56,50.09 11.56,51.05 11.05,51.55 v11.05,59.87
!CH2_RESET  (via drill 0.6)  (2 unrouted)
  Top 0.254: 15.43,46.85 15.37,46.79 v12,46.79
  Bottom 0.254: X4.5 5.01,28.05 | v12,46.79 11.62,46.41 11.62,31.98 8.95,29.31 6.29,29.31 5.02,28.04
!CONVEND1  (via drill 0.6)
  Top 0.254: v75.25,69.59 75.63,69.97 127.25,69.97 v127.57,70.29 | v131.25,39.93 131.51,40.19 177.29,40.19 181.23,36.25 IC3.6
  Bottom 0.254: MCU.21 v75.25,69.59 | v131.25,39.93 131.25,64.51 127.57,68.19 v127.57,70.29
!CONVEND2  (via drill 0.6)  (1 unrouted)
  Top 0.254: v22.16,62.67 20.89,62.67 | v47.82,74.35 47.24,74.92 25.27,74.92 v21.59,71.24
  Bottom 0.254: MCU.20 77.79,73.53 76.33,74.92 48.39,74.92 v47.82,74.35 | v22.16,62.67 21.59,63.24 21.59,70.54 21.59,70.6 v21.59,71.24
!DAC1_SELECT  (via drill 0.6)
  Top 0.254: IC2.5 181.48,50.66 177.67,54.48 127.51,54.48 v127.06,54.03 | 88.27,66.92 v87.95,67.24 88.84,66.35 101.16,66.35 103.69,63.81 125.92,63.81 v126.68,63.05
  Bottom 0.254: MCU.16 v87.95,67.24 | v127.06,54.03 127.06,62.67 v126.68,63.05
!DAC2_SELECT  (via drill 0.6)
  Top 0.254: MCU.47 64.77,40.12 56.77,40.12 55.44,41.46 26.29,41.46 v25.65,42.09 25.97,41.77 | IC4.5 23.62,61.4 25.27,59.74 v25.46,59.74
  Bottom 0.254: v25.65,42.09 25.46,42.28 v25.46,59.74
!EEPROM_SELECT  (via drill 0.6)
  Top 0.254: MCU.49 65.98,37.9 67.18,39.11 68.77,39.11 71.18,36.7 v80.64,36.7 | v82.23,51.17 82.23,50.6 | 82.23,50.6 82.23,50.47 | IC8.1 82.23,50.6
  Bottom 0.254: v82.23,51.17 82.23,38.28 v80.64,36.7
!ETH_IRQ  (via drill 0.6)
  Top 0.254: v82.87,66.6 68.83,66.6 68.33,67.11 64.39,67.11 63.94,66.67 52.01,66.67 50.48,65.14 44.9,65.14 v44.77,64.76 | IC9.36 40.85,49.19 41.4,48.63 44.45,48.63 v44.64,48.82
  Bottom 0.254: MCU.18 v82.87,66.6 | v44.77,64.76 45.09,64.44 45.09,61.65 44.9,61.46 44.9,60.51 45.02,60.38 45.02,49.2 v44.64,48.82
!ETH_SELECT  (via drill 0.6)
  Top 0.254: 127.57,73.33 MCU.11 127.57,71.62 126.49,70.54 69.22,70.54 68.33,69.65 64.77,69.65 62.93,67.81 50.35,67.81 48.26,65.72 43.12,65.72 v42.8,65.33 | v40.26,55.05 40.13,55.05 38.85,53.76 IC9.32
  Bottom 0.254: v42.8,65.33 43.05,65.08 43.05,57.46 40.64,55.05 v40.26,55.05
!IO_EXPANDER1  (via drill 0.6)
  Top 0.254: IC2.4 181.04,51.94 177.99,54.98 125.79,54.98 v125.41,54.6 | v85.41,66.54 85.41,66.48 86.11,65.78 100.9,65.78 103.44,63.24 124.21,63.24 v124.59,62.86
  Bottom 0.254: v125.41,54.6 125.41,62.03 v124.59,62.86 | MCU.17 v85.41,66.54
!IO_EXPANDER2  (via drill 0.6)
  Top 0.254: MCU.46 66.36,39.17 59.94,39.17 58.99,38.22 56.71,38.22 56.13,38.79 51.75,38.79 49.66,40.89 25.53,40.89 24.7,41.71 24.7,43.93 v23.69,44.95 | IC4.4 v22.86,60.13
  Bottom 0.254: v22.86,60.13 23.11,59.87 23.11,54.86 24.07,53.9 24.07,45.33 v23.69,44.95
!ISOLATOR1_EN  (via drill 0.6)  (1 unrouted)
  Top 0.254: v96.08,67.3 96.46,66.92 101.41,66.92 103.89,64.44 v128.65,64.44 | 182.63,48.06 182.56,48.12 181.1,48.12 176.72,52.51 161.86,52.51 161.23,51.87 152.34,51.87 151.7,51.24 128.65,51.24 v128.08,50.66
  Bottom 0.254: v128.65,64.44 128.46,64.25 128.46,51.05 v128.08,50.66 | v96.08,67.3 96.08,70.41 MCU.14
!ISOLATOR2_EN  (via drill 0.6)
  Top 0.254: IC6.7 27.81,51.87 v28.13,52.19 | v41.91,49.59 41.91,49.65 42.04,49.78 48.26,49.78 50.1,51.62 50.1,52.82 51.37,54.09 51.37,56 52.01,56.63 62.61,56.63 v62.87,56.89
  Bottom 0.254: v28.13,52.19 28.51,51.81 39.37,51.81 41.59,49.59 v41.91,49.59 | MCU.45 63.88,44.19 63.88,50.6 62.48,52 62.48,56.51 v62.87,56.89
!PWD_RST  (via drill 0.6)
  Top 0.254: JP1.1 57.15,18.53 v58.48,19.87 | v67.31,24.12 67.44,24 74.04,24 MCU.A13
  Bottom 0.254: v67.31,24.12 61.4,24.12 58.48,21.2 v58.48,19.87
!RESET  (via drill 0.6)
  Top 0.254: IC3.3 179.9,40.06 178.05,41.9 175.96,41.9 175.29,42.57 | v129.03,44 129.41,44.38 136.08,44.38 137.22,43.24 174.62,43.24 175.29,42.57 | IC6.3 24.7,46.79 25.65,45.84 30.86,45.84 v30.92,45.9 | v47.94,60.83 49.28,60.83 50.16,61.71 56.01,61.71 58.93,64.64 68.26,64.64 70.29,62.6 123.44,62.6 124.14,61.9 128.91,61.9 v129.41,62.41 133.54,66.54 135,66.54 135.45,66.98 IC14.7 | IC9.37 44.05,51.22 v44.13,51.3 47.56,51.3 v47.75,51.49 | IC12.1 175.46,62.87 174.17,61.57 IC12.6 174.17,59.06 v174.18,59.05 | v175.58,42.85 175.29,42.57
  Bottom 0.254: MCU.RESET 129.03,25.65 v129.03,44 129.03,62.03 v129.41,62.41 | v30.92,45.9 30.99,45.84 34.73,45.84 35.43,46.54 41.15,46.54 43.69,49.08 43.69,50.85 v44.13,51.3 | v47.75,51.49 47.69,51.55 47.69,60.57 v47.94,60.83 | v175.58,42.85 175.58,57.65 v174.18,59.05
!RTC_IRQ  (via drill 0.6)
  Top 0.254: v80.33,68.51 80.64,68.83 88.84,68.83 90.11,67.56 90.87,67.56 91.57,68.25 96.46,68.25 97.22,67.49 102.17,67.49 v102.42,67.24 | IC7.5 103.86,51.27 104.08,51.49 104.08,52.06 v104.65,52.63
  Bottom 0.254: v80.33,68.51 MCU.19 | v104.65,52.63 105.66,53.65 105.66,64 v102.42,67.24
+3V3  (via drill 0.6)  (10 unrouted)
  Top 0.254: IC5.4 v153.67,70.16 | C18.1 146.86,62.49 146.88,62.48 | 47.05,69.21 52.07,69.21 R21.2 | R15.2 v43.18,33.46 | D7.A 111.44,57.02 111.32,57.14 | IC8.3 84.45,47.87 85.72,49.14 87.44,49.14 | 87.44,49.14 87.5,49.2 | 87.44,49.14 87.44,50.36 IC8.8 | 89.53,50.6 C24.1 | X4.15 6.28,39.47 9.73,39.47 12.51,36.7 15.81,36.7 16.76,35.74 v19.18,35.74 | X2.15 199,37.32 197.74,38.58 196.14,38.58 195.14,37.58 195.14,36.57 191.13,32.57 184.59,32.57 184.15,33.01 184.15,34.28 183.45,34.98 IC3.7 181.42,34.98 v181.1,35.3 | 33.85,54.73 33.78,54.73 | IC4.7 v19.75,63.94 | IC9.28 36.85,47.68 C34.2 | C34.2 36.09,47.27 | IC9.4 39.35,60.04 40.01,60.7 40.01,60.76 C39.1 | IC9.8 37.35,60.18 | C40.1 37.35,60.92 37.35,60.18 | IC9.11 35.85,58.88 35.5,59.24 34.42,59.24 33.4,60.25 C35.1 | 37.35,60.18 v37.4,60.13 | 36.51,47.13 C34.2 | 42.42,60.7 42.42,58.28 42.63,58.07 RN2.8 RN2.7 RN2.6 | 42.42,60.7 42.48,60.76 | 42.42,60.7 42.42,60.89
  Top 0.305: R26.1 150.12,49.14 | 150.12,49.14 150.62,48.63 | IC9.17 33.85,54.73 33.08,54.73 32.26,55.55 32,55.55 31.69,55.87 | IC9.15 33.11,55.72 32.83,56 32.83,57.33 32.32,57.84 C38.1 | IC9.21 33.13,52.72 32.26,53.59 31.96,53.59 C36.1 | 150.12,49.14 150.12,48.63 150.18,48.57 151.51,48.57 v151.57,48.51 | R14.1 | R14.1 R16.2 | 47.05,69.21 v44.01,69.21 42.99,68.19 R14.1 | C28.1 31.11,61.9 v31.88,61.14 | IC12.8 175.46,59.99 175.96,59.49 175.96,59.09 C47.2
  Top 0.406: IC3.1 181.55,42.6 181.17,42.98 181.17,44.16 C14.1 181.1,44.23 v181.1,45.14 | v177.42,57.14 181.1,57.14 181.42,57.46 | IC2.1 182.25,55.74 181.42,56.57 181.42,57.44 C12.1 | IC1.24 100.65,39.12 100.65,40.95 C6.1 | v90.49,50.6 89.53,50.6 | IC8.8 89.18,50.41 C24.1 | 47.09,69.21 Q7.2 47.18,69.14 | C35.1 33.4,61.14 v31.88,61.14 | 36.51,47.13 36.09,47.13 36.07,47.11 36.07,45.71 v36.01,45.65 | 87.12,39.49 87.19,39.42 v88.08,39.42 88.09,39.44 IC13.5 | v133.86,61.46 134.81,61.46 134.87,61.4 | IC14.2 135.45,63.17 135.38,63.11 135.38,61.87 C48.2 | C47.2 176.19,57.24 176.09,57.14
  Top 0.508: 21.78,54.79 21.78,56.13 21.59,56.32 IC4.1 | IC6.1 C20.1 20.92,40.47 v20.89,40.63 | X6.1 60.39,18.28 60.58,18.47 | v19.81,54.98 21.78,54.98 21.84,54.92
  Top 0.61: v101.35,41.65 100.39,41.65 C6.1 | v43.18,26.34 45.47,26.34 46.23,25.58 JP2.3 | C36.1 C37.1 C38.1 31.65,59.6 C41.+ 31.88,60.51 v31.88,61.14
  Top 0.813: v145.73,61.71 145.73,62.48 146.88,62.48 147.89,62.48 | v43.18,26.34 43.18,18.72 47.12,14.79 56.83,14.79 60.58,18.53 60.58,18.47 60.71,18.6 | 60.71,18.72 60.71,18.6 | v20.89,40.63 22.16,39.36 v43.18,39.36 | 60.71,18.6 60.99,18.88 | v45.85,60.89 42.42,60.89 40.13,60.89 40.01,60.76 | 40.01,60.7 40.01,60.19 v39.94,60.13
  Top 1.016: v177.42,57.14 176.09,57.14 v151.57,57.14 v145.73,57.14 v133.86,57.14 111.44,57.14 D7.A | 111.32,57.14 v101.35,57.14 v90.49,57.14 | v90.49,22.79 64.9,22.79 60.99,18.88 60.58,18.47
  Bottom 0.254: v19.18,35.74 19.24,35.81 19.24,36.89 20.89,38.54 v20.89,40.63 | v181.1,35.3 180.97,35.17 179.64,35.17 177.29,37.52 177.29,45.01 177.42,45.14 | 19.81,64 v19.75,63.94 19.81,63.87 v19.81,54.98 | v151.57,57.14 v151.57,48.51
  Bottom 0.406: v181.1,45.14 177.42,45.14 | v36.01,45.65 36.07,45.65 36.58,45.14 45.59,45.14 45.85,45.08 | v88.08,39.42 90.49,39.42 | v44.01,69.21 44.01,72.89 X7.8 | v133.86,57.14 v133.86,61.46
  Bottom 0.61: v177.42,57.14 177.42,45.14 | v101.35,57.14 v101.35,41.65 | v45.85,60.89 45.78,60.89 45.78,60.95 45.91,61.08 45.91,65.65 44.01,67.56 v44.01,69.21
  Bottom 0.813: v43.18,39.36 43.18,42.22 45.66,44.7 45.85,45.08 v45.85,60.89 | v20.89,40.63 20.89,53.9 v19.81,54.98 | v39.94,60.13 v37.4,60.13 32.89,60.13 v31.88,61.14
  Bottom 1.016: v145.73,57.14 v145.73,61.71 145.73,67.75 | v90.49,57.14 v90.49,50.6 90.49,39.42 v90.49,22.79 | v43.18,26.34 v43.18,33.46 v43.18,39.36
  other vias: 148.46,72.45 148.46,71.3 148.46,70.16 148.46,69.02 148.46,67.87 153.67,72.45 153.67,71.3 153.67,69.02 153.67,67.87 151,72.45 151,71.3 151,70.16 151,69.02 151,67.87
  pour Bottom (isolate 0.305): 168.47,76.83 168.47,64.44 144.78,64.44 144.78,76.83
+5V  (via drill 0.6)  (12 unrouted)
  Top 0.254: 56.77,6.02 54.42,6.02 R2.2 | R1.2 150.62,23.87 151.64,24.88 151.64,25.52 Q1.2 | v37.78,38.16 44.07,38.16 v44.51,37.71 | 163.7,71.62 C17.1 | C17.1 163.58,71.68 | 163.44,72.44 163.44,71.77 C17.1
  Top 0.305: v39.5,24 38.48,24.06 R7.2 38.15,23.73 Q5.2 | 148.02,23.68 149.48,23.68 R1.2
  Top 0.406: 61.28,5.07 57.72,5.07 56.77,6.02 | C2.1 61.28,5.07 | 148.02,23.68 148.02,23.61 | 143.38,7.8 D2.C 143.57,7.8 146.05,10.28 146.05,15.74 145.99,15.8 | 148.02,29.65 | 148.08,29.39 148.02,29.33 | 148.08,28.25 148.02,28.19 | 134.53,38 134.43,37.9 | FB.P$1 134.28,38.35 123.64,38.35 v123.19,38.47 | 61.28,5.07 69.09,5.07 74.8,10.79 v74.8,17.14
  Top 0.508: Q3.2 56.76,6.04 | 148.02,23.61 148.02,17.84 145.99,15.8 145.81,15.63 Q2.2 R4.2 | v36.26,26.79 37.78,26.79 39.43,25.14
  Top 0.61: 148.02,23.68 148.02,28.19 148.02,29.33 148.02,29.65 | v148.02,30.73 148.02,29.65 | v39.5,24 39.5,25.14 42.55,28.19 v44.51,28.19 | 44.53,23.69 44.51,23.68 | SG1.+B 112.33,66.41 | SG1.+ SG1.+B | v109.6,65.52 108.97,65.52 C23.2 | SG1.+B 112.2,66.41 111.95,66.67 109.1,66.67 C23.2 | JP2.1 44.53,21.41 44.51,21.39
  Top 0.813: v44.51,25.01 44.51,23.68 44.51,21.39 44.51,19.04 47.69,15.87 56.2,15.87 65.72,25.39 68.33,25.39 69.53,26.6 78.04,26.6 v78.17,26.73
  Top 1.016: v164.53,58.48 v147.09,58.48 v123.19,58.48 v109.6,58.48 v78.17,58.48 | IC5.3 163.44,72.44 163.45,72.44 | 163.7,71.62 165.1,71.62 v166.37,70.35
  Bottom 0.254: v44.51,28.19 44.13,28.57 44.13,37.33 v44.51,37.71 | v37.78,38.16 37.21,38.16 32.45,42.92 LED_PROG2.A | 189.05,61.26 188.98,61.33 189.99,61.33 | LED_PWR.A 191.05,60.25 SW1.3 | LED_PROG1.A 172.55,45.82 169.74,48.63 164.61,48.63 164.55,48.57
  Bottom 0.305: LED_S1.A 165.93,42.12 165.93,27.42 164.91,26.41 | 24.45,62.48 LED_CC2.A | LED_O1_NEG.1 LED_O1_NEG.3 | LED_CV2.A 166.27,62.5 166.37,62.6 | 166.36,61.3 166.36,61.39 166.37,61.4 | 166.5,61.46 166.5,61.36 166.56,61.3
  Bottom 0.406: LED_CV1.A | v74.8,17.14 74.8,22.15 76.52,23.87 76.52,26.09 77.09,26.66 78.23,26.66
  Bottom 0.508: v39.5,24 39.24,23.8 25.78,23.8 24.48,25.11 LED_O2.A | LED_S2.A 24.45,42.73 | LED_S2.A 24.45,41.46 25.08,40.83 25.08,40.82 27.56,38.35 33.97,38.35 36.26,36.06 v36.26,26.79 | 24.38,55.49 24.45,55.42 24.77,55.42 24.77,43.5 | LED_S2.A 24.77,43.5 | 24.77,43.5 24.77,43.49
  Bottom 0.61: LED_CC1.A 164.55,48.57 LED_S1.A | 164.53,55.51 v164.53,58.48 | v109.6,65.52 v109.6,58.48 | v147.09,58.48 147.09,31.66 v148.02,30.73
  Bottom 0.813: v44.51,25.01 v44.51,28.19
  Bottom 1.016: 164.53,55.51 164.53,55.49 | 166.37,61.4 166.37,62.6 v166.37,70.35 | SW1.3 166.56,61.3 166.36,61.3 | v78.17,58.48 v78.17,26.73 | v123.19,58.48 v123.19,38.47 123.19,25.52 MCU.5V | v164.53,58.48 164.53,59.49 166.5,61.46
AUX1_USET_IN  (via drill 0.6)
  Top 0.254: X2.11 198.97,42.36 197.68,41.06 196.09,41.06 194.56,39.54 194.56,36.82 191.26,33.52 v190.75,33.52 | v183.58,27.68 174.56,27.68 173.61,28.63 ZD5.C
  Top 0.508: ZD5.C 171.98,30.17 X1.8
  Bottom 0.254: v190.75,33.52 189.42,33.52 v183.58,27.68
  Bottom 0.406: X1.8.1 X1.8
AUX2_USET_IN
  Top 0.254: X4.11 5.01,35.67 6.29,34.39 10.81,34.39 11.81,33.39 19.56,33.39 21.02,31.93 33.02,31.93 X3.6
  Top 0.406: X3.6.1 34.42,37.44 ZD6.C
  Bottom 0.406: X3.6.1 X3.6
BATT_NTC  (via drill 0.6)  (1 unrouted)
  Top 0.254: OK1.4 154.05,47.74 153.86,47.55 150.37,47.55 150.05,47.24 150.05,47.05 R26.2 149.8,46.98 | v106.05,46.16 106.55,45.65 138.62,45.65 139.26,46.28 149.22,46.28 149.86,46.92
  Bottom 0.254: MCU.A4 100.65,25.39 106.68,31.42 106.68,40.7 106.05,41.33 v106.05,46.16
BP_SELECT  (via drill 0.6)
  Top 0.254: IC1.4 102.56,34.87 102.74,35.04 108.08,35.04 108.71,34.41 119.44,34.41 v119.76,34.73 119.51,34.47
  Bottom 0.254: v119.76,34.73 119.76,42.6 120.78,43.62 120.78,71.75 MCU.9
BUZZER  (2 unrouted)
  Top 0.254: MCU.12 130.11,68.19 127.25,65.33 125.73,65.33
  Top 0.305: Q6.1 125.54,65.21 125.67,65.33 | 125.79,65.33 R11.2
CH1_GND  (via drill 0.6)  (1 unrouted)
  Top 0.254: C44.2 173.82,47.13 174.62,47.93 IC11.1 | 173.86,45.9 173.86,46.16 173.8,46.22 C44.2 | C44.2 173.86,46.22 | C44.2 174.14,45.9 176.28,45.9 176.97,45.2 178.05,45.2 C45.1 178.94,43.93 v178.94,43.49 | C44.2 172.81,45.2 168.15,45.2 167.89,45.46 v166.81,45.46 166.43,45.84 164.59,45.84 163.89,46.41 159.64,46.41 159.38,46.66 159.38,49.27 159.96,49.84 OK1.2
  Top 0.508: ZD5.A 167.88,29.92 X1.6
  Bottom 0.406: v178.94,43.49 186.31,43.49 | X1.6.1 X1.6
  Bottom 0.508: X1.6 168.66,29.14 183.07,29.14 185.67,31.74
  pour Top (isolate 0.305): 185.42,31.61 185.42,58.48 204.47,58.48 204.47,36.42 195.75,36.42 190.94,31.61
  pour Bottom (isolate 0.305): 185.42,31.61 185.42,58.48 204.47,58.48 204.47,36.44 195.8,36.44 190.97,31.61
CH1_MISO  (via drill 0.6)
  Top 0.254: IC2.11 v191.01,49.4
  Bottom 0.254: X2.9 197.76,46.14 194.26,46.14 v191.01,49.4
CH1_MOSI
  Top 0.254: IC2.14 192.99,53.2 196.02,56.24 197.82,56.24 X2.1
CH1_SCLK
  Top 0.254: X2.7 197.76,48.68 195.96,48.68 195.26,47.98 195.26,47.05 190.82,42.6 190.82,39.04 189.29,37.52 IC3.12
CH1_VDD  (via drill 0.6)  (1 unrouted)
  Top 0.254: IC2.10 v189.42,48.12 | IC3.10 189.17,34.98 192.41,38.22 192.41,41.97 v192.47,42.03 | IC11.8 170.62,48 172.15,48 | 167.77,46.41 164.91,46.41 164.72,46.6 164.72,48.06 165.06,48.4 IC10.1 | 171.74,45.84 C44.1 | IC10.4 167.75,46.42 167.77,46.41 | C44.1 170.81,46.22 170.37,45.78 168.4,45.78 167.77,46.41 | C44.1 172.15,46.22 | v180.72,47.17 180.72,47.68 176.66,51.74 IC11.4 172.91,51.74 v172.72,51.55 | 172.15,48 172.66,48 v172.72,48.06 | C44.1 172.12,47.97 172.15,48
  Top 0.406: v189.42,44.25 C13.1 188.53,44.25 188.53,42.6 IC3.16 | IC2.16 187.99,55.81 188.53,55.81 188.43,55.91 188.43,57.4 C11.1 v196.28,57.46
  Bottom 0.254: v189.42,44.25 190.25,44.25 v192.47,42.03 | v172.72,51.55 v172.72,48.06
  Bottom 0.305: v180.72,47.17 189.42,47.17
  Bottom 0.406: v189.42,44.25 189.42,47.17 v189.42,48.12 189.42,51.08 193.41,55.06 X2.2 196.46,57.28 v196.28,57.46
CH2_GND  (via drill 0.6)
  Top 0.406: ZD6.A 31.88,36.04 X3.5.1 31.88,35.49 30.61,34.22 20.45,34.22 20,34.66
  Bottom 0.406: X3.5.1 X3.5
  other vias: 13.78,53.4 13.97,45.2 11.49,29.19 9.84,52.13
  pour Top (isolate 0.305, rank 2): -0.95,66.54 18.1,66.54 18.1,38.92 20.32,38.92 20.32,21.14 -0.95,22.14
  pour Bottom (isolate 0.305, rank 2): -0.95,66.54 18.1,66.54 18.1,39.55 19.05,39.55 19.05,21.14 -0.95,22.14
CH2_MISO  (via drill 0.6)
  Top 0.254: IC6.11 10.67,50.6 v10.6,50.66
  Bottom 0.254: v10.6,50.66 10.6,50.35 9.91,49.65 9.91,33.82 7.94,31.85 6.28,31.85 X4.9
CH2_MOSI  (via drill 0.6)
  Top 0.254: IC4.14 v12.76,58.86
  Bottom 0.254: X4.1 5.02,22.97 6.29,24.23 8.45,24.23 12.76,28.55 12.76,45.4 13.46,46.09 13.46,50.66 12.76,51.36 v12.76,58.86
CH2_SCLK  (via drill 0.6)  (1 unrouted)
  Top 0.254: 5,30.6 X4.7 5.02,30.59 6.29,31.85 9.34,31.85 v9.53,32.04 | IC6.12 11.05,49.33
  Bottom 0.254: v9.53,32.04 10.48,33 10.48,48.82 v10.99,49.33
CH2_VDD  (via drill 0.6)
  Top 0.254: IC4.10 v14.35,63.94 | IC6.10 14.35,51.87 v14.29,52
  Top 0.406: IC6.16 14.96,44.25 14.96,42.83 14.73,42.6 C19.1 14.99,42.32 v14.99,41.65 | v13.72,54.73 C15.1 14.92,54.73 14.99,54.79 14.99,56.32 IC4.16
  Bottom 0.254: 15.68,53.08 15.68,52.02 IC6.10 14.35,51.87 v14.29,52 | v14.35,63.94 14.35,55.36 v13.72,54.73
  Bottom 0.406: v14.99,41.65 15.68,41.65
  Bottom 0.508: v13.72,54.73 13.78,54.67 14.1,54.67 15.68,53.08 15.68,41.65 15.68,29.77 8.85,22.94 X4.2
EARTH  (1 unrouted)
  Top 0.508: C5.1 C1.2 184.05,5.45 J2.P$1
  Bottom 0.406: X1.3.1 X1.3 159.64,30.28 161.29,28.63 162.56,28.63 163.51,27.68 163.51,21.64 164.4,20.76 184.91,20.76 192.15,13.52
EARTH2  (via drill 0.6)  (1 unrouted)
  Top 0.305: C31.2 C28.2 X7.3
  Top 0.406: J5.P$2 J5.P$1 | C10.1 14.35,5.45 8.95,10.85 8.95,17.39 v18.1,26.54 | X3.1.1 21.72,36 19.49,38.22 v18.1,38.22 | C8.2 41.78,5.96 41.85,6.02 22.54,6.02 22.04,5.52 C10.1
  Bottom 0.406: v18.1,26.54 v18.1,38.22 18.41,38.54 18.41,40.06 18.03,40.44 18.03,66.98 J5.P$1 19.94,74.86 29.34,74.86 X7.3 | X3.1 X3.1.1
ETH_ACTLED  (via drill 0.6)
  Top 0.254: IC9.27 36.35,49.17 35.94,48.76 33.72,48.76 32.77,47.81 28.57,47.81 v28.32,47.55 | v28.13,67.11 R22.1
  Bottom 0.254: v28.32,47.55 28.32,48 27.18,49.14 27.18,53.52 28.19,54.54 28.19,56.44 27.62,57.02 27.62,60.89 28.19,61.46 28.19,67.05 v28.13,67.11
ETH_IN+  (via drill 0.6)
  Top 0.254: C32.1 34.33,66.64 v34.35,66.67 | R18.1 34.48,70.09 34.48,72.25 X7.4
  Bottom 0.254: v34.35,66.67 34.35,72.38 X7.4
ETH_IN-  (via drill 0.6)
  Top 0.254: C30.1 37.5,66.63 v37.47,66.67 | R17.2 36.9,70.09 36.45,70.54 36.45,72.83 X7.5
  Bottom 0.254: v37.47,66.67 37.47,70.22 36.2,71.49 X7.5
ETH_LINKLED  (via drill 0.6)
  Top 0.254: IC9.25 33.83,49.69 32.51,48.38 28.83,48.38 28.64,48.57 27.56,48.57 v26.99,48 | R23.1 v25.53,67.17
  Bottom 0.254: v26.99,48 26.61,48.38 26.61,53.78 27.62,54.79 27.62,56.25 27.5,56.38 27.05,56.83 27.05,61.14 27.62,61.71 27.62,65.33 25.78,67.17 v25.53,67.17
ETH_OUT+  (via drill 0.6)
  Top 0.254: IC9.2 40.35,58.88 41.08,59.62 v41.27,59.62 | R16.1 38.99,72.83 X7.6
  Bottom 0.254: v41.27,59.62 41.91,60.25 41.91,64.06 41.27,64.7 41.27,66.1 39.75,67.62 39.75,72.06 X7.6
ETH_OUT-  (via drill 0.6)
  Top 0.254: IC9.1 41.42,58.24 v41.47,58.28 | R14.2 40.96,72.76 X7.7
  Bottom 0.254: v41.47,58.28 41.47,58.48 42.48,59.49 42.48,64.32 41.85,64.95 41.85,72.51 X7.7
EXT_TRIG  (via drill 0.6)
  Top 0.254: v92.71,43.49 91.82,43.49 R32.1
  Bottom 0.254: MCU.A7 93.03,43.17 v92.71,43.49
FAN_PWM
  Top 0.254: MCU.6 113.98,73.46 115.19,72.25 116.39,72.25 117.09,72.95 117.09,74.1 117.98,74.92 139.83,74.92 140.4,74.35 172.4,74.35 174.31,72.44 X5.4
FAN_SENSE
  Top 0.254: X5.3 173.04,70.86 173.04,72.89 172.15,73.78 140.53,73.78 138.43,71.68 134.43,71.68 MCU.13
GND  (via drill 0.6)  (2 unrouted)
  Top 0.254: IC9.29 37.35,50.68 37.47,50.79
  Top 0.305: 37.35,50.39 IC9.29
  Top 0.406: C2.2 61.42,7.88 63.93,7.88 64.01,7.8 63.82,7.8 63.75,7.87 66.67,7.87 67.44,8.63 | v134.24,16.44 134.24,19.99 135.25,21.01 | 31.94,22.54 31.88,22.47 20.77,22.47 20,21.71 20,19.61 20.89,18.72 K_S2.8 | v71.44,15.55 71.44,12.62 K_SER.A1
  Bottom 0.406: SW2.5 SW2.1 SW2.2 134.25,16.36 v134.24,16.44 | v71.44,15.55 71.44,23.8 71.5,23.87 | X1.1.1 X1.1 | 158.37,26.66 158.31,26.6
  Bottom 0.61: 35.18,56.19 SH1.P$1
  other vias: 57.15,37.27 100.77,63.75 71.06,58.16 179.51,58.41 180.97,41.33 184.09,45.71 156.84,61.46 140.46,25.96 158.43,26.98 138.87,61.46 57.34,30.34 76.83,35.36 86.93,27.93 59.75,32.69 58.55,34.66 95.57,73.46 118.43,73.53 57.34,64.57 51.05,59.62 60.33,73.46 50.93,28.19 22.54,65.02 19.37,45.52 40.96,62.6 60.33,63.43 25.46,61.08 50.93,25.27 51.05,31.36 29.4,44.89 47.62,45.39 82.8,27.93 73.03,30.47 79.5,35.42 104.78,27.36 114.17,38.47 99.69,33.71 159.7,53.46 97.47,42.92 123.83,68.38 76.96,67.87 102.87,49.33 84.33,46.6 91.82,52.51 119.82,52 116.97,52.95 148.27,38.66 141.22,34.85 126.24,43.43 126.24,48.12 125.73,40.31 99.89,55.24 178.12,34.22 140.14,48.12 165.67,44.76 22.48,53.14 182.56,32.69 171.01,59.24 168.21,38.6 33.4,46.92 31.75,26.85 138.87,53.46 37.34,63.75 37.34,50.86 42.86,46.28 28.64,53.52 38.67,37.2 71.06,73.46 45.72,67.81 29.91,66.29 29.15,61.65 47.88,72.64 32.38,62.73 44.01,62.41 48.64,55.68 167.96,62.92 119,60.83 123.19,60.83 95.38,61.33 88.2,61.33 76.26,61.33 108.9,48.12 114.17,35.36 148.34,48.12 56.13,49.01
  pour Bottom (isolate 0.305, rank 3): 204.79,77.02 204.79,59.11 184.47,59.11 184.47,31.61 173.99,31.61 173.99,37.33 155.89,37.33 155.89,29.07 160.02,29.07 160.34,28.76 160.34,23.68 149.54,23.68 146.05,20.18 134.05,20.18 134.05,23.68 69.85,23.68 65.72,19.55 65.72,14.79 44.45,14.79 38.73,20.5 30.48,20.5 30.48,27.8 36.2,27.8 36.2,37.46 34.29,39.49 18.73,39.49 18.73,77.02
  pour Top (isolate 0.305, rank 3): 204.79,77.02 204.79,59.11 184.47,59.11 184.47,31.61 177.48,31.61 173.99,35.11 173.99,37.33 173.67,37.65 160.15,37.65 159.38,37.65 156.21,37.65 155.89,37.33 155.89,29.07 159.07,29.07 160.34,27.8 160.34,20.82 134.05,20.82 134.05,23.68 69.85,23.68 65.72,19.55 65.72,14.79 44.45,14.79 38.73,20.5 30.48,20.5 30.48,27.8 36.2,27.8 36.2,39.49 18.73,39.49 18.73,77.02
GNDA  (via drill 0.6)  (1 unrouted)
  Top 0.254: IC9.48 42.38,56.99 42.04,57.33 39.88,57.33 39.85,57.36 | IC9.3 39.85,57.36 | R19.1 35.63,62.85 36.51,61.97 36.51,59.68 36.85,59.34 IC9.9 36.85,57.35 36.83,57.33 | v38.42,56.95 38.42,57.33 | 33.57,56.2 33.58,56.22 IC9.14 34.77,56.22 34.8,56.19 | IC9.19 34.62,53.73 34.8,53.9 34.8,55.24 | 34.8,55.24 34.8,56.19 | IC9.16 34.78,55.22 34.8,55.24 | 36.83,57.33 35.31,57.33 34.8,56.83 34.8,56.25 34.8,56.19 | 36.83,57.33 38.42,57.33 | 38.42,57.33 39.82,57.33 39.85,57.36
  Top 0.305: 33.57,53.73 IC9.19 33.85,53.71 IC9.19
  Bottom 0.254: C42.- 37.15,56.19 37.66,56.19 | v38.42,56.95 37.85,56.95 37.66,56.76 37.66,56.19
  Bottom 0.61: 37.15,56.19 36.7,56.89 SH1.P$2
  pour Top (isolate 0.305, no thermals): 42.67,56.7 34.86,56.7 34.86,53.71 33.53,53.71 33.53,57.78 34.04,58.28 41.53,58.28 42.67,57.14
LCD_BRIGHTNESS
  Top 0.254: MCU.7 115,73.46 113.47,74.92 54.67,74.92 52.77,73.08 R21.1 | R21.1 51.31,71.81 50.61,71.11 47.12,71.11 Q7.1 | R21.1 52.96,71.81
LCD_CS
  Top 0.254: LCD1.15 53.81,51.49 55.37,51.49 55.94,50.92 56.71,50.92 57.09,51.3 64.07,51.3 64.77,50.6 MCU.39
LCD_DB0  (via drill 0.6)
  Top 0.254: MCU.37 65.91,53.14 67.18,51.87 71.56,51.87 v72.07,51.49
  Bottom 0.254: v72.07,51.49 71.69,51.11 71.69,28.76 69.34,26.41 62.87,26.41 57.59,21.14 57.59,19.23 55.6,17.24 LCD1.21
LCD_DB1  (via drill 0.6)
  Top 0.254: v71.44,53.46 67.94,53.46 MCU.36
  Bottom 0.254: LCD1.22 55.41,19.78 62.61,26.98 69.09,26.98 71.12,29.01 71.12,53.14 v71.44,53.46
LCD_DB2
  Bottom 0.254: LCD1.23 55.48,22.32 60.71,27.55 68.83,27.55 70.55,29.27 70.55,53.84 68.83,55.55 68.83,56.13 68.07,56.89 66.29,56.89 MCU.35
LCD_DB3
  Bottom 0.254: LCD1.24 56.11,24.86 59.37,28.12 68.58,28.12 69.98,29.52 69.98,53.59 67.88,55.68 MCU.34
LCD_DB4
  Bottom 0.254: MCU.33 64.71,58.22 62.99,59.94 62.23,59.94 61.34,59.05 61.34,51.49 62.74,50.09 62.74,49.4 61.47,48.12 61.47,47.36 62.1,46.73 62.1,43.55 62.61,43.05 62.61,33.01 57,27.4 LCD1.25
LCD_DB5
  Bottom 0.254: MCU.32 66.36,59.49 64.26,59.49 63.25,60.51 61.98,60.51 60.77,59.3 60.77,49.08 60.33,48.63 60.33,46.85 60.96,46.22 60.96,43.05 61.47,42.54 61.47,36.06 55.35,29.94 LCD1.26
LCD_DB6
  Bottom 0.254: MCU.31 64.77,61.08 61.72,61.08 60.2,59.55 60.2,49.33 59.75,48.89 59.75,46.66 60.39,46.03 60.39,42.79 60.9,42.28 60.9,38.35 LCD1.27
LCD_DB7  (1 unrouted)
  Bottom 0.254: LCD1.28 56.81,35.02 60.33,38.54 60.33,42.03 59.82,42.54 59.82,45.78 59.18,46.41 59.18,49.08 59.63,49.52 59.63,59.74 61.85,61.97 66.48,61.97 67.63,60.83
LCD_DB8  (via drill 0.6)
  Top 0.254: 52.5,32.45 LCD1.7 53.75,31.23 55.94,31.23 56.26,31.55 68.96,31.55 70.29,32.88 v74.3,32.88
  Bottom 0.254: MCU.22 68.77,70.92 73.91,65.78 73.91,35.87 74.3,35.49 v74.3,32.88
LCD_DB9  (via drill 0.6)
  Top 0.254: LCD1.8 52.5,34.99 53.78,33.71 64.07,33.71 64.45,34.09 69.09,34.09 69.98,34.98 v73.34,34.98
  Bottom 0.254: v73.34,34.98 73.34,65.59 69.28,69.65 67.12,69.65 65.85,70.92 MCU.23
LCD_DB10
  Bottom 0.254: LCD1.9 52.48,37.56 50.16,39.87 50.16,56.51 49.47,57.21 49.47,60.95 49.78,61.27 49.78,65.65 49.4,66.03 49.4,66.92 50.16,67.68 62.67,67.68 64.52,69.53 65.6,69.53 66.74,68.38 MCU.24
LCD_DB11  (via drill 0.6)
  Top 0.254: MCU.25 64.83,68.38 63.69,67.24 51.82,67.24 51.05,66.48 v50.35,66.48
  Bottom 0.254: LCD1.10 51.71,40.1 50.74,41.08 50.74,56.76 50.04,57.46 50.04,60.7 50.35,61.02 v50.35,66.48
LCD_DB12
  Bottom 0.254: LCD1.11 52.55,42.64 53.78,43.87 55.31,43.87 56.58,45.14 56.58,45.84 57.66,46.92 57.66,50.28 58.48,51.11 58.48,60.25 61.34,63.11 62.23,63.11 63.88,64.76 63.88,66.29 64.71,67.11 65.66,67.11 66.93,65.84 MCU.26
LCD_DB13  (via drill 0.6)
  Top 0.254: MCU.27 57.15,65.84 55.5,64.19 v48.83,64.19 | LCD1.12 49.24,45.18 v49.21,45.2
  Bottom 0.254: v48.83,64.19 49.21,63.81 49.21,61.52 48.9,61.21 48.9,56.95 49.59,56.25 49.59,45.78 49.21,45.4 v49.21,45.2
LCD_DB14  (via drill 0.6)  (1 unrouted)
  Top 0.254: MCU.28 66.36,62.03 64.71,62.03 63.37,60.7 57.53,60.7 v57.47,60.63
  Bottom 0.254: v57.47,60.63 57.91,60.19 57.91,51.3 57.09,50.47 57.09,47.17 56.39,46.47 53.72,46.47 52.51,47.68
LCD_DB15  (via drill 0.6)
  Top 0.254: v58.67,61.71 63.5,61.71 MCU.29
  Bottom 0.254: v58.67,61.71 57.21,61.71 56.52,61.02 56.52,60.25 57.28,59.49 57.28,51.49 56.71,50.92 55.94,50.92 55.44,51.43 53.67,51.43 LCD1.14
LCD_RD  (1 unrouted)
  Top 0.254: LCD1.6 50.63,29.94 47.18,33.39
LCD_RESET  (via drill 0.6)
  Top 0.254: MCU.38 66.36,51.87 v56.33,51.87
  Bottom 0.254: LCD1.17 53.75,56.63 55.37,56.63 56.71,55.3 56.71,52.25 v56.33,51.87
LCD_RS  (via drill 0.6)
  Top 0.254: v62.42,47.74 64.77,47.74 MCU.41
  Bottom 0.254: LCD1.4 53.78,26.15 56.58,26.15 63.18,32.76 63.18,43.3 62.74,43.74 62.74,47.43 v62.42,47.74
LCD_WR  (via drill 0.6)
  Top 0.254: MCU.40 66.36,49.33 62.17,49.33 v61.72,49.78
  Bottom 0.254: LCD1.5 53.73,28.63 57.47,28.63 62.04,33.2 62.04,42.79 61.53,43.3 61.53,46.47 60.9,47.11 60.9,48.38 61.72,49.2 v61.72,49.78